# Altium project PCB_Project1.PrjPCB
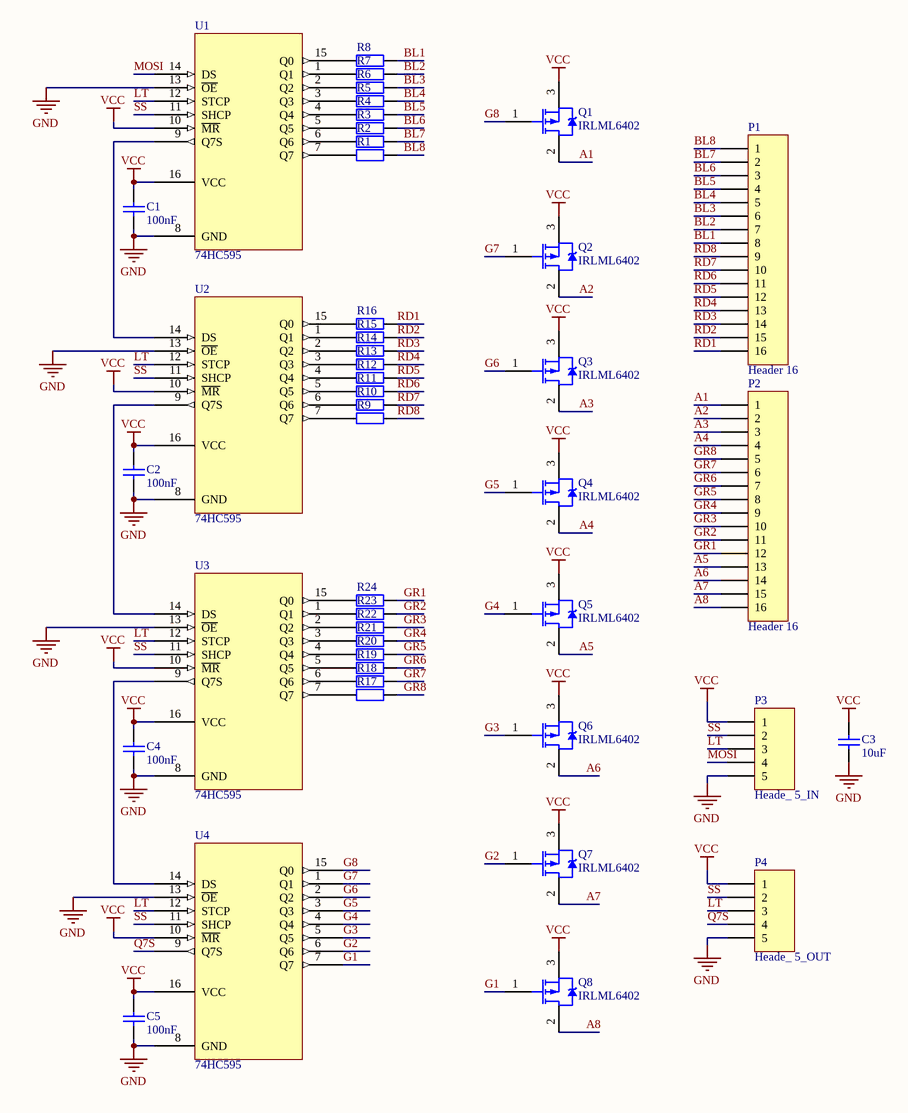
[diagram p0: schematic.SchDoc]
1 sheet, 45 parts. Net scope: global (net labels, ports and power ports of the same name join across sheets).
Board files: BOARD.PcbDoc, PRINT.PcbDoc

## Sheet schematic.SchDoc
size A3

### Parts
C1  value 100nF  [6-0805_M]  (hidden comment: Cap)
C2  value 100nF  [6-0805_M]  (hidden comment: Cap)
C3  value 10uF  [6-0805_M]  (hidden comment: Cap)
C4  value 100nF  [6-0805_M]  (hidden comment: Cap)
C5  value 100nF  [6-0805_M]  (hidden comment: Cap)
P1  Header 16  [HDR1X16]
P2  Header 16  [HDR1X16]
P3  Heade_ 5_IN  [HDR1X5]
P4  Heade_ 5_OUT  [HDR1X5]
Q1  IRLML6402  [SOT95P237X112-3N]
Q2  IRLML6402  [SOT95P237X112-3N]
Q3  IRLML6402  [SOT95P237X112-3N]
Q4  IRLML6402  [SOT95P237X112-3N]
Q5  IRLML6402  [SOT95P237X112-3N]
Q6  IRLML6402  [SOT95P237X112-3N]
Q7  IRLML6402  [SOT95P237X112-3N]
Q8  IRLML6402  [SOT95P237X112-3N]
R1  Res2  [6-0805_M]  (value not drawn)
R2  Res2  [6-0805_M]  (value not drawn)
R3  Res2  [6-0805_M]  (value not drawn)
R4  Res2  [6-0805_M]  (value not drawn)
R5  Res2  [6-0805_M]  (value not drawn)
R6  Res2  [6-0805_M]  (value not drawn)
R7  Res2  [6-0805_M]  (value not drawn)
R8  Res2  [6-0805_M]  (value not drawn)
R9  Res2  [6-0805_M]  (value not drawn)
R10  Res2  [6-0805_M]  (value not drawn)
R11  Res2  [6-0805_M]  (value not drawn)
R12  Res2  [6-0805_M]  (value not drawn)
R13  Res2  [6-0805_M]  (value not drawn)
R14  Res2  [6-0805_M]  (value not drawn)
R15  Res2  [6-0805_M]  (value not drawn)
R16  Res2  [6-0805_M]  (value not drawn)
R17  Res2  [6-0805_M]  (value not drawn)
R18  Res2  [6-0805_M]  (value not drawn)
R19  Res2  [6-0805_M]  (value not drawn)
R20  Res2  [6-0805_M]  (value not drawn)
R21  Res2  [6-0805_M]  (value not drawn)
R22  Res2  [6-0805_M]  (value not drawn)
R23  Res2  [6-0805_M]  (value not drawn)
R24  Res2  [6-0805_M]  (value not drawn)
U1  74HC595  [TSOP65P640X110-16M]
U2  74HC595  [TSOP65P640X110-16M]
U3  74HC595  [TSOP65P640X110-16M]
U4  74HC595  [TSOP65P640X110-16M]

### Nets
GND: C1.1 C2.1 C3.1 C4.1 C5.1 P3.5 P4.5 U1.8(GND) U1.13(~{OE}) U2.8(GND) U2.13(~{OE}) U3.8(GND) U3.13(~{OE}) U4.8(GND) U4.13(~{OE})
VCC: C1.2 C2.2 C3.2 C4.2 C5.2 P3.1 P4.1 Q1.3(S) Q2.3(S) Q3.3(S) Q4.3(S) Q5.3(S) Q6.3(S) Q7.3(S) Q8.3(S) U1.10(~{MR}) U1.16(VCC) U2.10(~{MR}) U2.16(VCC) U3.10(~{MR}) U3.16(VCC) U4.10(~{MR}) U4.16(VCC)
A1: P2.1 Q1.2(D)
A2: P2.2 Q2.2(D)
A3: P2.3 Q3.2(D)
A4: P2.4 Q4.2(D)
A5: P2.13 Q5.2(D)
A6: P2.14 Q6.2(D)
A7: P2.15 Q7.2(D)
A8: P2.16 Q8.2(D)
BL1: P1.8 R8.2
BL2: P1.7 R7.2
BL3: P1.6 R6.2
BL4: P1.5 R5.2
BL5: P1.4 R4.2
BL6: P1.3 R3.2
BL7: P1.2 R2.2
BL8: P1.1 R1.2
G1: Q8.1(G) U4.7(Q7)
G2: Q7.1(G) U4.6(Q6)
G3: Q6.1(G) U4.5(Q5)
G4: Q5.1(G) U4.4(Q4)
G5: Q4.1(G) U4.3(Q3)
G6: Q3.1(G) U4.2(Q2)
G7: Q2.1(G) U4.1(Q1)
G8: Q1.1(G) U4.15(Q0)
GR1: P2.12 R24.2
GR2: P2.11 R23.2
GR3: P2.10 R22.2
GR4: P2.9 R21.2
GR5: P2.8 R20.2
GR6: P2.7 R19.2
GR7: P2.6 R18.2
GR8: P2.5 R17.2
LT: P3.3 P4.3 U1.12(STCP) U2.12(STCP) U3.12(STCP) U4.12(STCP)
MOSI: P3.4 U1.14(DS)
Q7S: P4.4 U4.9(Q7S)
RD1: P1.16 R16.2
RD2: P1.15 R15.2
RD3: P1.14 R14.2
RD4: P1.13 R13.2
RD5: P1.12 R12.2
RD6: P1.11 R11.2
RD7: P1.10 R10.2
RD8: P1.9 R9.2
SS: P3.2 P4.2 U1.11(SHCP) U2.11(SHCP) U3.11(SHCP) U4.11(SHCP)
NetR1_1: R1.1 U1.7(Q7)
NetR2_1: R2.1 U1.6(Q6)
NetR3_1: R3.1 U1.5(Q5)
NetR4_1: R4.1 U1.4(Q4)
NetR5_1: R5.1 U1.3(Q3)
NetR6_1: R6.1 U1.2(Q2)
NetR7_1: R7.1 U1.1(Q1)
NetR8_1: R8.1 U1.15(Q0)
NetR9_1: R9.1 U2.7(Q7)
NetR10_1: R10.1 U2.6(Q6)
NetR11_1: R11.1 U2.5(Q5)
NetR12_1: R12.1 U2.4(Q4)
NetR13_1: R13.1 U2.3(Q3)
NetR14_1: R14.1 U2.2(Q2)
NetR15_1: R15.1 U2.1(Q1)
NetR16_1: R16.1 U2.15(Q0)
NetR17_1: R17.1 U3.7(Q7)
NetR18_1: R18.1 U3.6(Q6)
NetR19_1: R19.1 U3.5(Q5)
NetR20_1: R20.1 U3.4(Q4)
NetR21_1: R21.1 U3.3(Q3)
NetR22_1: R22.1 U3.2(Q2)
NetR23_1: R23.1 U3.1(Q1)
NetR24_1: R24.1 U3.15(Q0)
NetU1_9: U1.9(Q7S) U2.14(DS)
NetU2_9: U2.9(Q7S) U3.14(DS)
NetU3_9: U3.9(Q7S) U4.14(DS)

### Library data of the parts
C1-C5 = Cap: Capacitor; Published: 8-Jun-2000; LatestRevisionDate: 17-Jul-2002; LatestRevisionNote: Re-released for DXP Platform.; PackageReference: RAD-0.3; Publisher: Altium Limited; PackageDescription: Radial Cap, Thru-Hole; 2 Leads; 0.3 in Pin Spacing
P1 P2 = Header 16: Header, 16-Pin; LatestRevisionDate: 17-Jul-2002; LatestRevisionNote: Re-released for DXP Platform.; Publisher: Altium Limited
P3 P4 = Header 5: Header, 5-Pin; LatestRevisionDate: 17-Jul-2002; LatestRevisionNote: Re-released for DXP Platform.; Publisher: Altium Limited
R1-R8 R18-R24 = Res2: Resistor; Value: 33; Published: 8-Jun-2000; LatestRevisionDate: 17-Jul-2002; LatestRevisionNote: Re-released for DXP Platform.; PackageReference: AXIAL-0.4; Publisher: Altium Limited; PackageDescription: Axial Device, Thru-Hole; 2 Leads; 0.4 in Pin Spacing
R9-R16 = Res2: Resistor; Value: 130; Published: 8-Jun-2000; LatestRevisionDate: 17-Jul-2002; LatestRevisionNote: Re-released for DXP Platform.; PackageReference: AXIAL-0.4; Publisher: Altium Limited; PackageDescription: Axial Device, Thru-Hole; 2 Leads; 0.4 in Pin Spacing
R17 = Res2: Resistor; Value: 30; Published: 8-Jun-2000; LatestRevisionDate: 17-Jul-2002; LatestRevisionNote: Re-released for DXP Platform.; PackageReference: AXIAL-0.4; Publisher: Altium Limited; PackageDescription: Axial Device, Thru-Hole; 2 Leads; 0.4 in Pin Spacing
U1-U4 = 74HC595: NXP